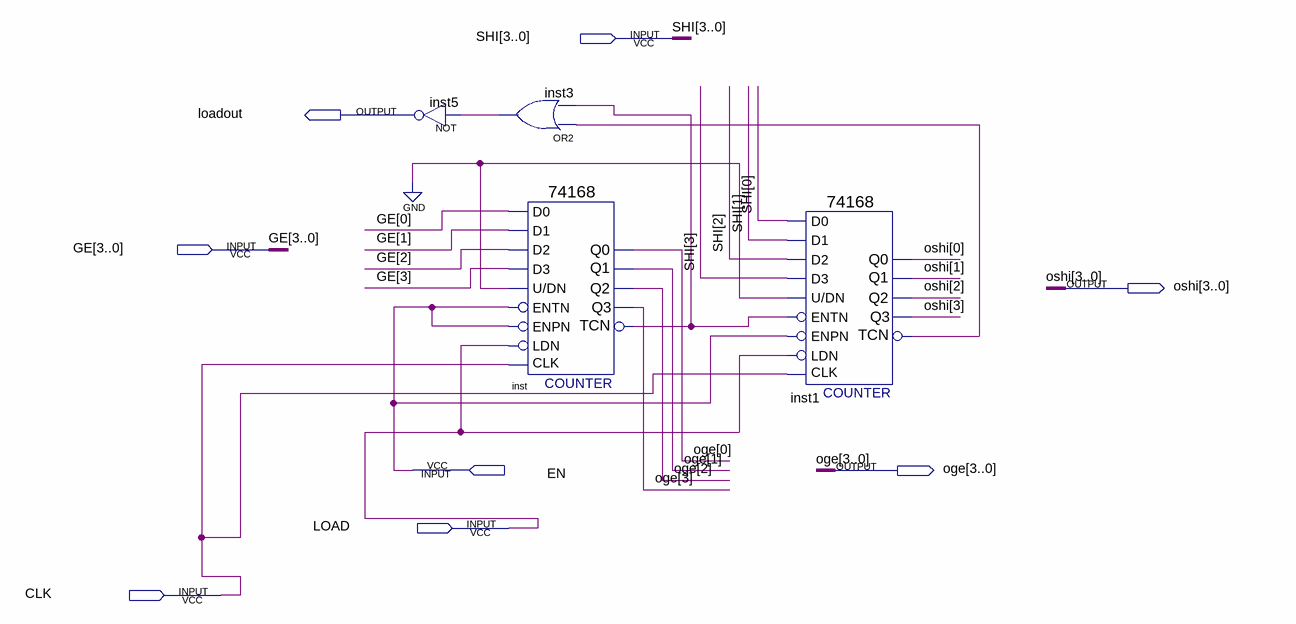
[diagram p0: schematic sheet]
// Quartus schematic Block4.bdf as structural Verilog: 4 symbols, 8 pins
module Block4 (
  input  [3:0] SHI,
  input  [3:0] GE,
  input  EN,
  input  LOAD,
  input  CLK,
  output loadout,
  output [3:0] oshi,
  output [3:0] oge
);

  wire inst1_tcn, inst3_out, inst_tcn;

  not inst5 (loadout, inst3_out);
  or inst3 (inst3_out, inst1_tcn, inst_tcn);
  \74168  inst (
    .D0(GE[0]), .D1(GE[1]), .D2(GE[2]), .D3(GE[3]), .\U/DN (1'b0), .ENPN(EN), .CLK(CLK), .ENTN(EN),
    .LDN(LOAD), .Q3(oge[3]), .TCN(inst_tcn), .Q1(oge[1]), .Q0(oge[0]), .Q2(oge[2]));
  \74168  inst1 (
    .D0(SHI[0]), .D1(SHI[1]), .D2(SHI[2]), .D3(SHI[3]), .\U/DN (1'b0), .ENPN(EN), .CLK(CLK), .ENTN(inst_tcn),
    .LDN(LOAD), .Q3(oshi[3]), .TCN(inst1_tcn), .Q1(oshi[1]), .Q0(oshi[0]), .Q2(oshi[2]));
endmodule
